# EAGLE schematic front-panel-revF-DEB-board1 (EAGLE 7.6.0), part 2 of 2
## Sheet 11 of 11
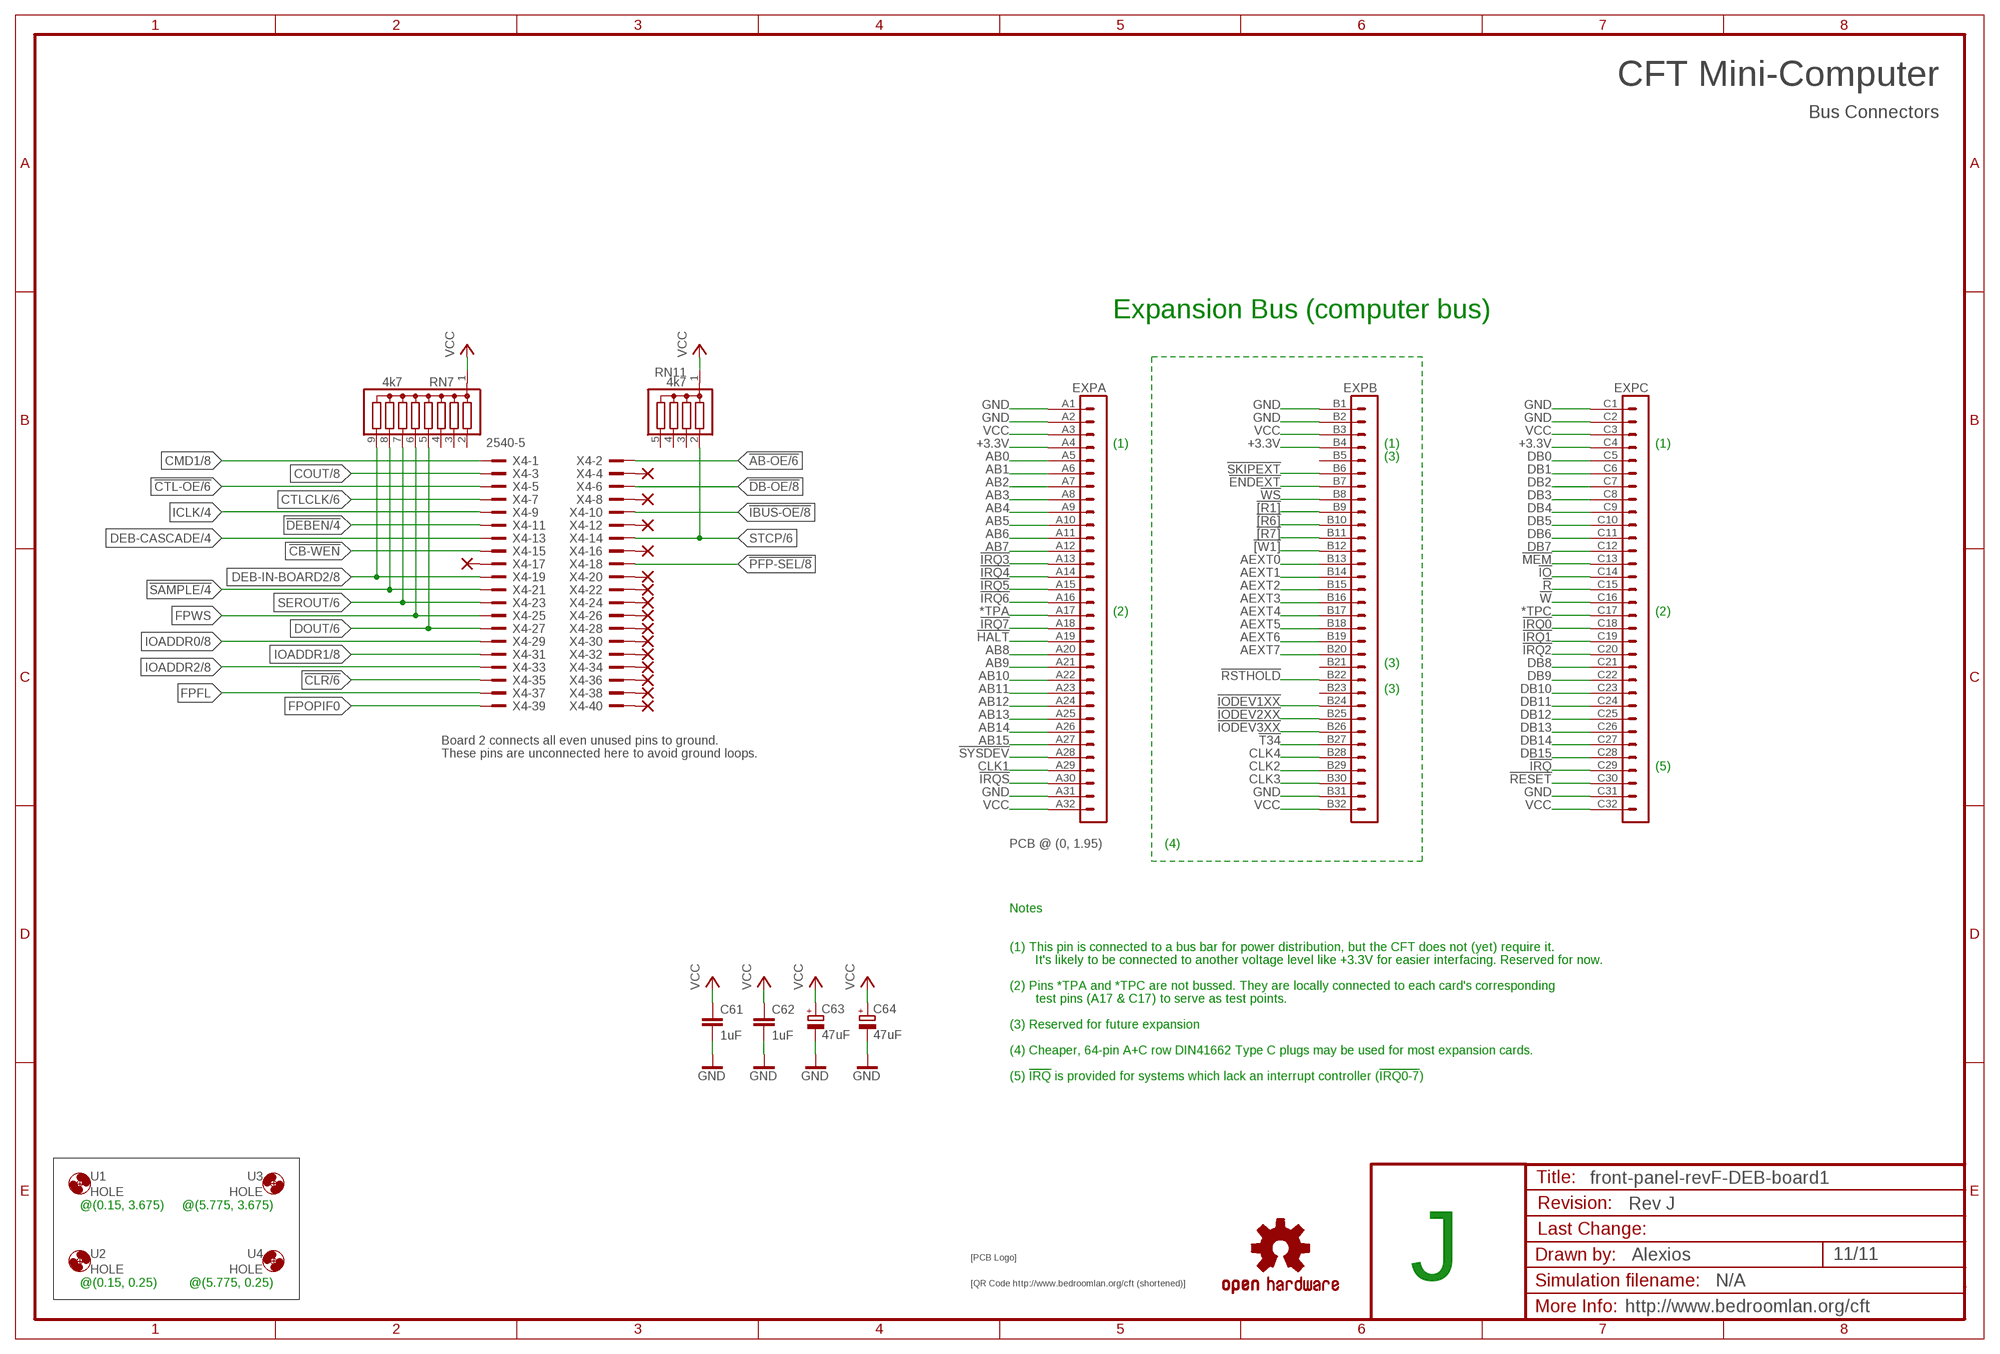
[diagram p10: schematic, sheet 11]
FRAME1 (FRAME-A3): DRAWN_BY: Alexios; PROJECT_NAME: CFT Mini-Computer; REVISION: Rev J; SHEET_DESCRIPTION: Bus Connectors; SIMULATION_FILENAME: N/A; URL: http://www.bedroomlan.org/cft

### Parts
$4_37_$  SIGNATURESILK  [SIGNATURE]
$4_39_$  OSHW-LOGOL  [OSHW-LOGO-L]
$4_40_$  QRCODE-CFT  [CFT-QRCODE]
C61  1uF  C-EUC0805K  [C0805K]
C62  1uF  C-EUC0805K  [C0805K]
C63  47uF  CPOL-EUE2.5-5  [E2,5-5]
C64  47uF  CPOL-EUE2.5-5  [E2,5-5]
EXP  VG96-3K  [VG96K]
NC5  2,54/1,0  [2,54/1,0]
NC6  2,54/1,0  [2,54/1,0]
NC7  2,54/1,0  [2,54/1,0]
NC8  2,54/1,0  [2,54/1,0]
NC27  2,54/1,0  [2,54/1,0]
NC28  2,54/1,0  [2,54/1,0]
NC29  2,54/1,0  [2,54/1,0]
NC30  2,54/1,0  [2,54/1,0]
NC31  2,54/1,0  [2,54/1,0]
NC32  2,54/1,0  [2,54/1,0]
NC33  2,54/1,0  [2,54/1,0]
NC34  2,54/1,0  [2,54/1,0]
NC35  2,54/1,0  [2,54/1,0]
NC36  2,54/1,0  [2,54/1,0]
NC37  2,54/1,0  [2,54/1,0]
NC38  2,54/1,0  [2,54/1,0]
RN7  4k7  G08R  [SIL9]
RN11  4k7  G04R  [SIL5]
U1  HOLE  [STANDOFF_28_60]
U2  HOLE  [STANDOFF_28_60]
U3  HOLE  [STANDOFF_28_60]
U4  HOLE  [STANDOFF_28_60]
X4  2540-5  [PAK100/2500-5-40]

### Nets
![R1]: EXP.B9
![R6]: EXP.B10
![R7]: EXP.B11
![W1]: EXP.B12
!AB-OE: X4.2 ; also sheet 6,8
!CB-WEN: X4.15 ; also sheet 5
!CLR: X4.35 ; also sheet 6,7,8
!CTL-OE: X4.5 ; also sheet 6,8
!DB-OE: X4.6 ; also sheet 8
!DEBEN: X4.11 ; also sheet 4,8
!ENDEXT: EXP.B7
!HALT: EXP.A19 ; also sheet 6
!IBUS-OE: X4.10 ; also sheet 8
!IO: EXP.C14 ; also sheet 6
!IODEV1XX: EXP.B24 ; also sheet 8
!IODEV2XX: EXP.B25
!IODEV3XX: EXP.B26
!IRQ: EXP.C29
!IRQ0: EXP.C18
!IRQ1: EXP.C19
!IRQ2: EXP.C20
!IRQ3: EXP.A13
!IRQ4: EXP.A14
!IRQ5: EXP.A15
!IRQ6: EXP.A16
!IRQ7: EXP.A18
!IRQS: EXP.A30
!MEM: EXP.C13 ; also sheet 6
!PFP-SEL: X4.18 ; also sheet 8
!R: EXP.C15 ; also sheet 5,6
!RESET: EXP.C30 ; also sheet 6,7
!RSTHOLD: EXP.B22 ; also sheet 6,7
!SAMPLE: RN7.8 X4.21 ; also sheet 4,5,8
!SKIPEXT: EXP.B6
!SYSDEV: EXP.A28
!T34: EXP.B27
!W: EXP.C16 ; also sheet 6
!WS: EXP.B8 ; also sheet 8
*TPA: EXP.A17
*TPC: EXP.C17
+3.3V [Power Rail]: EXP.A4 EXP.B4 EXP.C4
AB0: EXP.A5
AB1: EXP.A6
AB2: EXP.A7
AB3: EXP.A8
AB4: EXP.A9
AB5: EXP.A10 ; also sheet 8
AB6: EXP.A11 ; also sheet 8
AB7: EXP.A12 ; also sheet 8
AB8: EXP.A20
AB9: EXP.A21
AB10: EXP.A22
AB11: EXP.A23
AB12: EXP.A24
AB13: EXP.A25
AB14: EXP.A26
AB15: EXP.A27
AEXT0: EXP.B13
AEXT1: EXP.B14
AEXT2: EXP.B15
AEXT3: EXP.B16
AEXT4: EXP.B17
AEXT5: EXP.B18
AEXT6: EXP.B19
AEXT7: EXP.B20
CLK1: EXP.A29
CLK2: EXP.B29
CLK3: EXP.B30
CLK4: EXP.B28 ; also sheet 7
CMD1: X4.1 ; also sheet 8
COUT: X4.3 ; also sheet 8
CTLCLK: X4.7 ; also sheet 6
DB0: EXP.C5
DB1: EXP.C6
DB2: EXP.C7
DB3: EXP.C8
DB4: EXP.C9
DB5: EXP.C10
DB6: EXP.C11
DB7: EXP.C12
DB8: EXP.C21
DB9: EXP.C22
DB10: EXP.C23
DB11: EXP.C24
DB12: EXP.C25
DB13: EXP.C26
DB14: EXP.C27
DB15: EXP.C28
DEB-CASCADE: X4.13 ; also sheet 4
DEB-IN-BOARD2: RN7.9 X4.19 ; also sheet 8
DOUT: RN7.5 X4.27 ; also sheet 6,8
FPFL: X4.37 ; also sheet 3,5,9
FPOPIF0: X4.39 ; also sheet 5,9
FPWS: RN7.6 X4.25 ; also sheet 9
GND [low power]: C61.2 C62.2 C63.- C64.- EXP.A1 EXP.A2 EXP.A31 EXP.B1 EXP.B2 EXP.B31 EXP.C1 EXP.C2 EXP.C31 ; also sheet 2,3,4,5,6,7,8,9,10
ICLK: X4.9 ; also sheet 4,5,8
IOADDR0: X4.29 ; also sheet 4,5,8
IOADDR1: X4.31 ; also sheet 8
IOADDR2: X4.33 ; also sheet 8
N$32: NC6.1(P) X4.4
N$33: NC7.1(P) X4.8
N$34: NC8.1(P) X4.12
N$35: NC27.1(P) X4.16
N$36: NC28.1(P) X4.20
N$37: NC29.1(P) X4.22
N$46: NC38.1(P) X4.40
SEROUT: RN7.7 X4.23 ; also sheet 6
STCP: RN11.2 X4.14 ; also sheet 6
VCC [low power]: C61.1 C62.1 C63.+ C64.+ EXP.A3 EXP.A32 EXP.B3 EXP.B32 EXP.C3 EXP.C32 RN7.1 RN11.1 ; also sheet 3,4,5,6,7,8,10
Unconnected: EXP.B5 EXP.B21 EXP.B23 NC5.1(P) NC30.1(P) NC31.1(P) NC32.1(P) NC33.1(P) NC34.1(P) NC35.1(P) NC36.1(P) NC37.1(P) RN7.2 RN7.3 RN7.4 RN11.3 RN11.4 RN11.5 X4.17 X4.24 X4.26 X4.28 X4.30 X4.32 X4.34 X4.36 X4.38

### Notes on the sheet
- Expansion Bus (computer bus)
- (1) | (1) | (1)
- (3)
- (2) | (2)
- (3)
- (3)
- Board 2 connects all even unused pins to ground.
- These pins are unconnected here to avoid ground loops.
- (5)
- PCB @ (0, 1.95) | (4)
- Notes
- (1) This pin is connected to a bus bar for power distribution, but the CFT does not (yet) require it.
- It's likely to be connected to another voltage level like +3.3V for easier interfacing. Reserved for now.
- (2) Pins *TPA and *TPC are not bussed. They are locally connected to each card's corresponding
- test pins (A17 & C17) to serve as test points.
- (3) Reserved for future expansion
- (4) Cheaper, 64-pin A+C row DIN41662 Type C plugs may be used for most expansion cards.
- (5) !IRQ! is provided for systems which lack an interrupt controller (!IRQ0-7!)
- @(0.15, 3.675) | @(5.775, 3.675)
- J
- @(0.15, 0.25) | @(5.775, 0.25)

## Power pins joined to a net without a drawn wire
GND: IC1.8(GND) IC2.10(GND) IC3.10(GND) IC4.10(GND) IC5.10(GND) IC6.8(GND) IC7.8(GND) IC8.8(GND) IC9.8(GND) IC10.8(GND) IC11.8(GND) IC12.8(GND) IC13.8(P:GND) IC14.10(GND) IC16.8(GND) IC17.8(GND) IC18.8(GND) IC19.8(GND) IC20.8(GND) IC21.8(GND) IC22.8(GND) IC23.8(GND) IC24.8(GND) IC25.8(GND) IC32.8(GND) IC33.8(GND) IC35.8(GND) IC37.8(GND) IC38.7(P:GND) IC39.7(P:GND) IC40.8(GND) IC42.8(GND) IC43.8(GND) IC45.10(GND) IC47.10(GND) IC48.10(GND)
VCC: IC1.16(VCC) IC2.20(VCC) IC3.20(VCC) IC4.20(VCC) IC5.20(VCC) IC6.16(VCC) IC7.16(VCC) IC8.16(VCC) IC9.16(VCC) IC10.16(VCC) IC11.16(VCC) IC12.16(VCC) IC13.16(P:VCC) IC14.20(VCC) IC16.16(VCC) IC17.16(VCC) IC18.16(VCC) IC19.16(VCC) IC20.16(VCC) IC21.16(VCC) IC22.16(VCC) IC23.16(VCC) IC24.16(VCC) IC25.16(VCC) IC32.16(VCC) IC33.16(VCC) IC35.16(VCC) IC37.16(VCC) IC38.14(P:VCC) IC39.14(P:VCC) IC40.16(VCC) IC42.16(VCC) IC43.16(VCC) IC45.20(VCC) IC47.20(VCC) IC48.20(VCC)

## Library data of the parts
$4_37_$ = alexios:SIGNATURE: Soup signature
$4_39_$ = SparkFun:OSHW-LOGO: Open Source Hardware Logo This logo indicates the piece of hardware it is found on incorporates a OSHW license and/or adheres to the definition of open source hardware found here: http://freedomdefined.org/OSHW
$4_40_$ = alexios:QRCODE-*: Various QR codes in silkscreen.
C1-C12 C17-C59 C61 C62 = rcl:C-EU: CAPACITOR, European symbol
C63 C64 = rcl:CPOL-EU: POLARIZED CAPACITOR, European symbol
CON1 = alexios:AVR_SPI_PRG_6: AVR ISP 6 Pin This is the reduced ISP connector for AVR programming. Common on Arduino. This footprint will take up less PCB space and can be used with a 10-pin to 6-pin adapter such as SKU: BOB-08508
D1-D18 D31 D32 = alexios:1N4148: DIODE high speed (Philips)
EXP = alexios-19inch:VG96-3: PCB EUROCARD, 96-pin type C/ABC, 2.54 mm
IC1 IC42 = 74xx-eu:74*138: 3-line to 8-line DECODER/DEMULTIPLEXER
IC2-IC5 = alexios:74*541: Octal BUFFER and LINE DRIVER, 3-state
IC6-IC11 IC16-IC25 = alexios:74*165: 8-bit parallel load SHIFT REGISTER
IC12 IC32 IC33 IC35 = alexios:74*595: 8-bit SHIFT REGISTER, output latch
IC13 = alexios:74*112: Dual J-K negative edge triggered FLIP FLOP, preset and clear
IC14 IC45 IC47 IC48 = alexios:74*540: Octal BUFFER and LINE DRIVER, 3-state
IC37 = alexios:74*85: 4-bit magnitude COMPARATOR
IC38 IC39 = alexios:74*74: Dual D type positive edge triggered FLIP FLOP, preset and clear
IC40 = alexios:74*253: Dual 4-to 1 line data SELECTOR/MULTIPLEXER, 3-state
IC41 = alexios:MEGA8-P: MICROCONTROLLER 8 Kbytes FLASH, 1 kbytes SRAM, 512 bytes EEPROM, USART, 4-channel 10 bit ADC, 2-channel 8 bit ADC Pin compatible with Atmega48, ATMega88, ATMega168 Source: avr.lbr; OC_FARNELL: unknown; OC_NEWARK: unknown
IC43 = alexios:74*259: 8-bit addressable LATCH
JP1 = con-lstb:MA06-1: PIN HEADER; OC_FARNELL: unknown; OC_NEWARK: unknown
JP26-JP36 = jumper:JP2E: JUMPER
NC1-NC16 NC18-NC39 = wirepad:2,54/1,0: THROUGH-HOLE PAD
P1 P10-P14 = con-3m:2550-: 3M (TM) Pak 100 4-Wall Header Source: 3M; OC_FARNELL: unknown; OC_NEWARK: unknown
P4-P7 = con-3m:2540-: 3M (TM) Pak 100 4-Wall Header Source: 3M; OC_FARNELL: unknown; OC_NEWARK: unknown
P8 = con-lstb:MA05-1: PIN HEADER; OC_FARNELL: unknown; OC_NEWARK: unknown
P9 = con-panduit:057-020-: CONNECTOR 20-pin series 057 contact pc board low profile headers; OC_FARNELL: unknown; OC_NEWARK: unknown
Q2 = special:XTAL/S: CRYSTAL
R1-R38 = resistor:R-EU_: RESISTOR, European symbol
RN1-RN10 RN12-RN14 RN19 RN20 = resistor-sil:G08R: SIL RESISTOR; OC_FARNELL: unknown; OC_NEWARK: unknown
RN11 = resistor-sil:G04R: SIL RESISTOR; OC_FARNELL: unknown; OC_NEWARK: unknown
RN18 = resistor-sil:G03R: SIL RESISTOR; OC_FARNELL: unknown; OC_NEWARK: unknown
S1 S2 S7 S9-S24 S31 = switch:TL36PO: TINY SWITCH ON - ON Source: http://www2.produktinfo.conrad.com/datenblaetter/700000-724999/705152-da-01-de-Subminiaturschalter_TL_36YO.pdf
S3-S5 S25-S30 S32 = switch:TL37PO: TINY SWITCH MOM OFF MOM Source: http://www2.produktinfo.conrad.com/datenblaetter/700000-724999/705152-da-01-de-Subminiaturschalter_TL_36YO.pdf
S6 S8 = alexios-switches:TL39PO: TINY SWITCH ON OFF ON Source: http://www2.produktinfo.conrad.com/datenblaetter/700000-724999/705152-da-01-de-Subminiaturschalter_TL_36YO.pdf
SW1 = special:SW_DIP-8: DIP SWITCH
SW2 = special:SW_DIP-4: DIP SWITCH
SW3 = special:SW_DIP-3: DIP SWITCH
U1-U4 = alexios:HOLE: Hole for a standoff or mount. Hole diameter: 3.3mm. External Diameter: 6mm. Suitable for M3 standoffs.
X1 = con-3m:2534-: 3M (TM) Pak 100 4-Wall Header Source: 3M; OC_FARNELL: unknown; OC_NEWARK: unknown
X4 = con-3m:2540-: 3M (TM) Pak 100 4-Wall Header Source: 3M; OC_FARNELL: 9838414; OC_NEWARK: unknown

## Net classes
0 default: width 0.305 mm, clearance 0.203 mm
1 low power: width 1.27 mm, clearance 0.254 mm
2 Power Rail: width 0.61 mm, clearance 0.152 mm